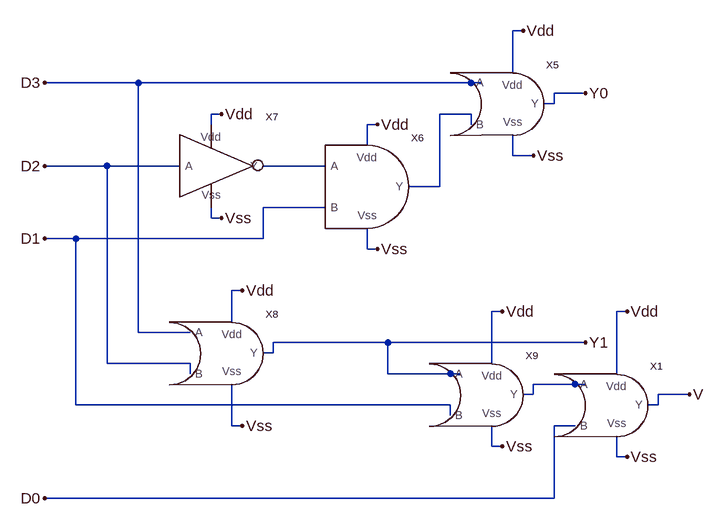
[diagram p0: schematic priority_encoder.asc]
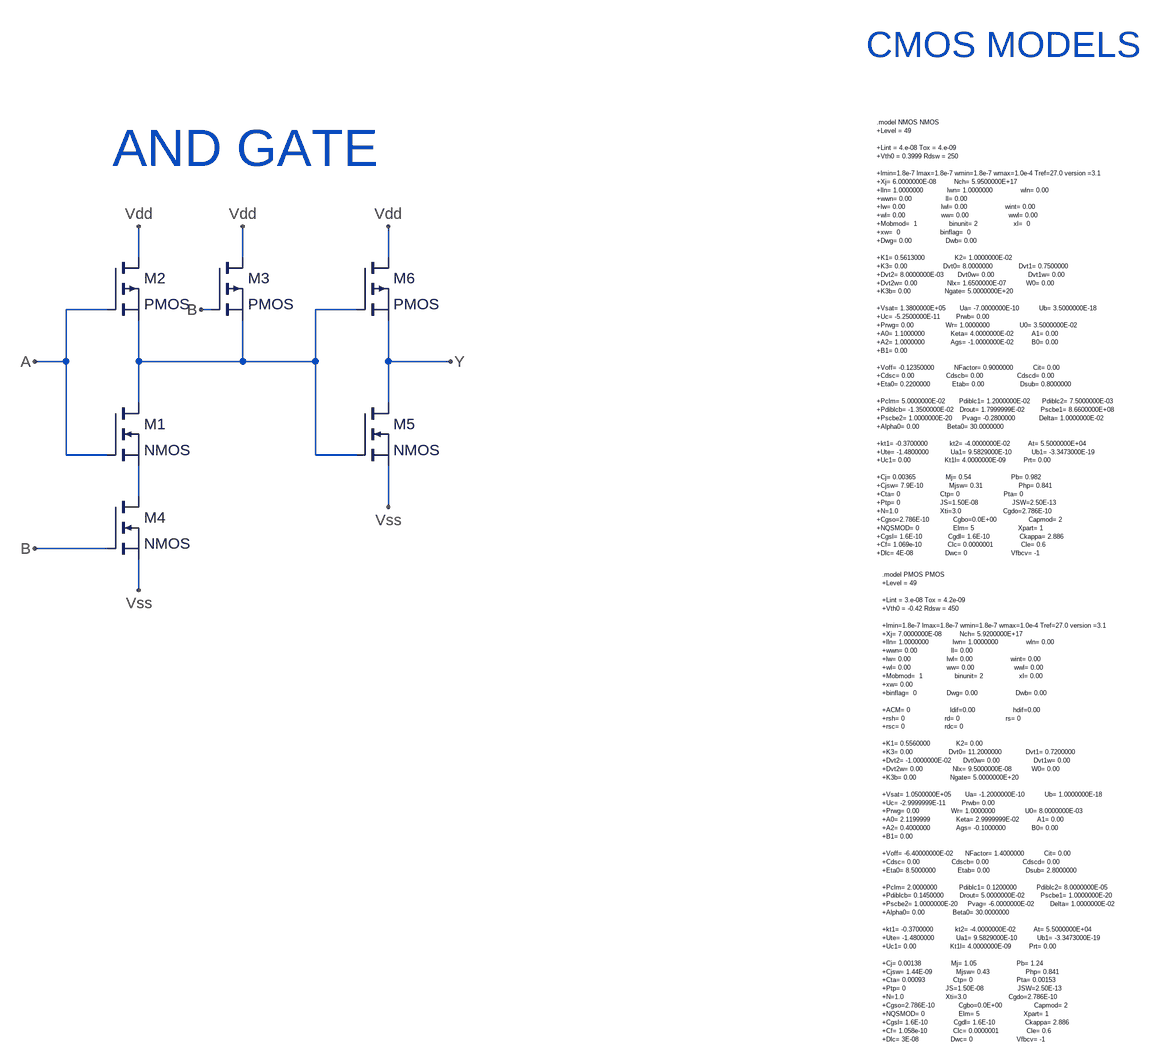
[diagram p1: sub-circuit and.asc]
priority_encoder.asc, the LTspice schematic file:
Version 4
SHEET 1 1840 712
WIRE 768 -112 752 -112
WIRE 752 -48 752 -112
WIRE 176 -32 32 -32
WIRE 688 -32 176 -32
WIRE 704 -32 688 -32
WIRE 864 -16 816 -16
WIRE 816 0 816 -16
WIRE 816 0 800 0
WIRE 304 16 288 16
WIRE 688 16 640 16
WIRE 288 32 288 16
WIRE 544 32 528 32
WIRE 688 32 688 16
WIRE 528 64 528 32
WIRE 752 80 752 48
WIRE 784 80 752 80
WIRE 128 96 32 96
WIRE 240 96 128 96
WIRE 464 96 368 96
WIRE 640 128 640 16
WIRE 640 128 592 128
WIRE 464 160 368 160
WIRE 288 176 288 160
WIRE 304 176 288 176
WIRE 80 208 32 208
WIRE 368 208 368 160
WIRE 368 208 80 208
WIRE 528 224 528 192
WIRE 544 224 528 224
WIRE 336 288 320 288
WIRE 736 320 720 320
WIRE 928 320 912 320
WIRE 320 336 320 288
WIRE 176 352 176 -32
WIRE 256 352 176 352
WIRE 560 368 384 368
WIRE 864 368 560 368
WIRE 384 384 384 368
WIRE 384 384 368 384
WIRE 128 400 128 96
WIRE 256 400 128 400
WIRE 720 400 720 320
WIRE 256 416 256 400
WIRE 560 416 560 368
WIRE 656 416 560 416
WIRE 672 416 656 416
WIRE 912 416 912 320
WIRE 848 432 784 432
WIRE 864 432 848 432
WIRE 784 448 784 432
WIRE 784 448 768 448
WIRE 1024 448 976 448
WIRE 80 464 80 208
WIRE 656 464 80 464
WIRE 976 464 976 448
WIRE 976 464 960 464
WIRE 656 480 656 464
WIRE 320 496 320 432
WIRE 336 496 320 496
WIRE 848 496 816 496
WIRE 720 528 720 496
WIRE 736 528 720 528
WIRE 912 544 912 512
WIRE 928 544 912 544
WIRE 816 608 816 496
WIRE 816 608 32 608
FLAG 32 208 D1
FLAG 32 96 D2
FLAG 32 -32 D3
FLAG 32 608 D0
FLAG 864 -16 Y0
FLAG 864 368 Y1
FLAG 1024 448 V
FLAG 304 16 Vdd
FLAG 544 32 Vdd
FLAG 768 -112 Vdd
FLAG 736 320 Vdd
FLAG 928 320 Vdd
FLAG 336 288 Vdd
FLAG 304 176 Vss
FLAG 544 224 Vss
FLAG 784 80 Vss
FLAG 736 528 Vss
FLAG 336 496 Vss
FLAG 928 544 Vss
SYMBOL or 768 -16 R0
SYMATTR InstName X5
SYMBOL and 528 128 R0
SYMATTR InstName X6
SYMBOL not 272 96 R0
SYMATTR InstName X7
SYMBOL or 336 368 R0
SYMATTR InstName X8
SYMBOL or 736 432 R0
SYMATTR InstName X9
SYMBOL or 928 448 R0
SYMATTR InstName X1

and.asc, the sub-circuit schematic file:
Version 4
SHEET 1 1908 1220
WIRE 368 64 368 16
WIRE 528 64 528 16
WIRE 752 64 752 16
WIRE 320 144 256 144
WIRE 480 144 464 144
WIRE 704 144 640 144
WIRE 256 224 256 144
WIRE 256 224 208 224
WIRE 368 224 368 160
WIRE 528 224 528 160
WIRE 528 224 368 224
WIRE 640 224 640 144
WIRE 640 224 528 224
WIRE 752 224 752 160
WIRE 848 224 752 224
WIRE 368 288 368 224
WIRE 752 288 752 224
WIRE 256 368 256 224
WIRE 320 368 256 368
WIRE 640 368 640 224
WIRE 704 368 640 368
WIRE 368 432 368 384
WIRE 752 448 752 384
WIRE 320 512 208 512
WIRE 368 576 368 528
FLAG 368 16 Vdd
FLAG 208 224 A
FLAG 528 16 Vdd
FLAG 208 512 B
FLAG 464 144 B
FLAG 752 16 Vdd
FLAG 848 224 Y
FLAG 368 576 Vss
FLAG 752 448 Vss
SYMBOL nmos 320 288 R0
SYMATTR InstName M1
SYMATTR Value2 L=0.18u W=1.0e-4
SYMBOL pmos 320 64 R0
SYMATTR InstName M2
SYMATTR Value2 L=0.18u W=1.0e-4
SYMBOL pmos 480 64 R0
SYMATTR InstName M3
SYMATTR Value2 L=0.18u W=1.0e-4
SYMBOL nmos 320 432 R0
SYMATTR InstName M4
SYMATTR Value2 L=0.18u W=1.0e-4
SYMBOL nmos 704 288 R0
SYMATTR InstName M5
SYMATTR Value2 L=0.18u W=1.0e-4
SYMBOL pmos 704 64 R0
SYMATTR InstName M6
SYMATTR Value2 L=0.18u W=1.0e-4
TEXT 328 -104 Left 6 ;AND GATE
TEXT 1504 -144 Left 0 !.model NMOS NMOS\n+Level = 49\n \n+Lint = 4.e-08 Tox = 4.e-09 \n+Vth0 = 0.3999 Rdsw = 250 \n \n+lmin=1.8e-7 lmax=1.8e-7 wmin=1.8e-7 wmax=1.0e-4 Tref=27.0 version =3.1\n+Xj= 6.0000000E-08         Nch= 5.9500000E+17 \n+lln= 1.0000000            lwn= 1.0000000              wln= 0.00\n+wwn= 0.00                 ll= 0.00\n+lw= 0.00                  lwl= 0.00                   wint= 0.00\n+wl= 0.00                  ww= 0.00                    wwl= 0.00\n+Mobmod=  1                binunit= 2                  xl=  0\n+xw=  0                    binflag=  0\n+Dwg= 0.00                 Dwb= 0.00 \n \n+K1= 0.5613000               K2= 1.0000000E-02 \n+K3= 0.00                  Dvt0= 8.0000000             Dvt1= 0.7500000 \n+Dvt2= 8.0000000E-03       Dvt0w= 0.00                 Dvt1w= 0.00 \n+Dvt2w= 0.00               Nlx= 1.6500000E-07          W0= 0.00 \n+K3b= 0.00                 Ngate= 5.0000000E+20 \n \n+Vsat= 1.3800000E+05       Ua= -7.0000000E-10          Ub= 3.5000000E-18 \n+Uc= -5.2500000E-11        Prwb= 0.00 \n+Prwg= 0.00                Wr= 1.0000000               U0= 3.5000000E-02 \n+A0= 1.1000000             Keta= 4.0000000E-02         A1= 0.00 \n+A2= 1.0000000             Ags= -1.0000000E-02         B0= 0.00 \n+B1= 0.00 \n \n+Voff= -0.12350000          NFactor= 0.9000000          Cit= 0.00 \n+Cdsc= 0.00                Cdscb= 0.00                 Cdscd= 0.00 \n+Eta0= 0.2200000           Etab= 0.00                  Dsub= 0.8000000 \n \n+Pclm= 5.0000000E-02       Pdiblc1= 1.2000000E-02      Pdiblc2= 7.5000000E-03 \n+Pdiblcb= -1.3500000E-02   Drout= 1.7999999E-02        Pscbe1= 8.6600000E+08 \n+Pscbe2= 1.0000000E-20     Pvag= -0.2800000            Delta= 1.0000000E-02 \n+Alpha0= 0.00              Beta0= 30.0000000 \n \n+kt1= -0.3700000           kt2= -4.0000000E-02         At= 5.5000000E+04 \n+Ute= -1.4800000           Ua1= 9.5829000E-10          Ub1= -3.3473000E-19 \n+Uc1= 0.00                 Kt1l= 4.0000000E-09         Prt= 0.00 \n \n+Cj= 0.00365               Mj= 0.54                    Pb= 0.982\n+Cjsw= 7.9E-10             Mjsw= 0.31                  Php= 0.841\n+Cta= 0                    Ctp= 0                      Pta= 0\n+Ptp= 0                    JS=1.50E-08                 JSW=2.50E-13\n+N=1.0                     Xti=3.0                     Cgdo=2.786E-10\n+Cgso=2.786E-10            Cgbo=0.0E+00                Capmod= 2\n+NQSMOD= 0                 Elm= 5                      Xpart= 1\n+Cgsl= 1.6E-10             Cgdl= 1.6E-10               Ckappa= 2.886\n+Cf= 1.069e-10             Clc= 0.0000001              Cle= 0.6\n+Dlc= 4E-08                Dwc= 0                      Vfbcv= -1
TEXT 1512 552 Left 0 !.model PMOS PMOS\n+Level = 49\n \n+Lint = 3.e-08 Tox = 4.2e-09 \n+Vth0 = -0.42 Rdsw = 450 \n \n+lmin=1.8e-7 lmax=1.8e-7 wmin=1.8e-7 wmax=1.0e-4 Tref=27.0 version =3.1\n+Xj= 7.0000000E-08         Nch= 5.9200000E+17 \n+lln= 1.0000000            lwn= 1.0000000              wln= 0.00\n+wwn= 0.00                 ll= 0.00\n+lw= 0.00                  lwl= 0.00                   wint= 0.00\n+wl= 0.00                  ww= 0.00                    wwl= 0.00\n+Mobmod=  1                binunit= 2                  xl= 0.00\n+xw= 0.00                  \n+binflag=  0               Dwg= 0.00                   Dwb= 0.00 \n \n+ACM= 0                    ldif=0.00                   hdif=0.00\n+rsh= 0                    rd= 0                       rs= 0\n+rsc= 0                    rdc= 0\n \n+K1= 0.5560000             K2= 0.00 \n+K3= 0.00                  Dvt0= 11.2000000            Dvt1= 0.7200000 \n+Dvt2= -1.0000000E-02      Dvt0w= 0.00                 Dvt1w= 0.00 \n+Dvt2w= 0.00               Nlx= 9.5000000E-08          W0= 0.00 \n+K3b= 0.00                 Ngate= 5.0000000E+20 \n \n+Vsat= 1.0500000E+05       Ua= -1.2000000E-10          Ub= 1.0000000E-18 \n+Uc= -2.9999999E-11        Prwb= 0.00 \n+Prwg= 0.00                Wr= 1.0000000               U0= 8.0000000E-03 \n+A0= 2.1199999             Keta= 2.9999999E-02         A1= 0.00 \n+A2= 0.4000000             Ags= -0.1000000             B0= 0.00 \n+B1= 0.00 \n \n+Voff= -6.40000000E-02      NFactor= 1.4000000          Cit= 0.00 \n+Cdsc= 0.00                Cdscb= 0.00                 Cdscd= 0.00 \n+Eta0= 8.5000000           Etab= 0.00                  Dsub= 2.8000000 \n \n+Pclm= 2.0000000           Pdiblc1= 0.1200000          Pdiblc2= 8.0000000E-05 \n+Pdiblcb= 0.1450000        Drout= 5.0000000E-02        Pscbe1= 1.0000000E-20 \n+Pscbe2= 1.0000000E-20     Pvag= -6.0000000E-02        Delta= 1.0000000E-02 \n+Alpha0= 0.00              Beta0= 30.0000000 \n \n+kt1= -0.3700000           kt2= -4.0000000E-02         At= 5.5000000E+04 \n+Ute= -1.4800000           Ua1= 9.5829000E-10          Ub1= -3.3473000E-19 \n+Uc1= 0.00                 Kt1l= 4.0000000E-09         Prt= 0.00 \n \n+Cj= 0.00138               Mj= 1.05                    Pb= 1.24\n+Cjsw= 1.44E-09            Mjsw= 0.43                  Php= 0.841\n+Cta= 0.00093              Ctp= 0                      Pta= 0.00153\n+Ptp= 0                    JS=1.50E-08                 JSW=2.50E-13\n+N=1.0                     Xti=3.0                     Cgdo=2.786E-10\n+Cgso=2.786E-10            Cgbo=0.0E+00                Capmod= 2\n+NQSMOD= 0                 Elm= 5                      Xpart= 1\n+Cgsl= 1.6E-10             Cgdl= 1.6E-10               Ckappa= 2.886\n+Cf= 1.058e-10             Clc= 0.0000001              Cle= 0.6\n+Dlc= 3E-08                Dwc= 0                      Vfbcv= -1
TEXT 1488 -264 Left 5 ;CMOS MODELS

The netlist it stands for:
* priority_encoder.asc
XX5 D3 N001 Vdd Vss Y0 or  ; pins A B Vdd Vss Y
XX6 Vdd Vss N002 D1 N001 and
XX7 N002 D2 Vdd Vss not  ; pins Y A Vdd Vss
XX8 D3 D2 Vdd Vss Y1 or  ; pins A B Vdd Vss Y
XX9 Y1 D1 Vdd Vss N003 or  ; pins A B Vdd Vss Y
XX1 N003 D0 Vdd Vss V or  ; pins A B Vdd Vss Y

* block symbol definitions
.subckt and Vdd Vss A B Y
M1 N001 A N002 N002 NMOS L=0.18u W=1.0e-4
M2 Vdd A N001 N001 PMOS L=0.18u W=1.0e-4
M3 Vdd B N001 N001 PMOS L=0.18u W=1.0e-4
M4 N002 B Vss Vss NMOS L=0.18u W=1.0e-4
M5 Y N001 Vss Vss NMOS L=0.18u W=1.0e-4
M6 Vdd N001 Y Y PMOS L=0.18u W=1.0e-4
* AND GATE
.model NMOS NMOS
+Level = 49
+Lint = 4.e-08 Tox = 4.e-09
+Vth0 = 0.3999 Rdsw = 250
+lmin=1.8e-7 lmax=1.8e-7 wmin=1.8e-7 wmax=1.0e-4 Tref=27.0 version =3.1
+Xj= 6.0000000E-08         Nch= 5.9500000E+17
+lln= 1.0000000            lwn= 1.0000000              wln= 0.00
+wwn= 0.00                 ll= 0.00
+lw= 0.00                  lwl= 0.00                   wint= 0.00
+wl= 0.00                  ww= 0.00                    wwl= 0.00
+Mobmod=  1                binunit= 2                  xl=  0
+xw=  0                    binflag=  0
+Dwg= 0.00                 Dwb= 0.00
+K1= 0.5613000               K2= 1.0000000E-02
+K3= 0.00                  Dvt0= 8.0000000             Dvt1= 0.7500000
+Dvt2= 8.0000000E-03       Dvt0w= 0.00                 Dvt1w= 0.00
+Dvt2w= 0.00               Nlx= 1.6500000E-07          W0= 0.00
+K3b= 0.00                 Ngate= 5.0000000E+20
+Vsat= 1.3800000E+05       Ua= -7.0000000E-10          Ub= 3.5000000E-18
+Uc= -5.2500000E-11        Prwb= 0.00
+Prwg= 0.00                Wr= 1.0000000               U0= 3.5000000E-02
+A0= 1.1000000             Keta= 4.0000000E-02         A1= 0.00
+A2= 1.0000000             Ags= -1.0000000E-02         B0= 0.00
+B1= 0.00
+Voff= -0.12350000          NFactor= 0.9000000          Cit= 0.00
+Cdsc= 0.00                Cdscb= 0.00                 Cdscd= 0.00
+Eta0= 0.2200000           Etab= 0.00                  Dsub= 0.8000000
+Pclm= 5.0000000E-02       Pdiblc1= 1.2000000E-02      Pdiblc2= 7.5000000E-03
+Pdiblcb= -1.3500000E-02   Drout= 1.7999999E-02        Pscbe1= 8.6600000E+08
+Pscbe2= 1.0000000E-20     Pvag= -0.2800000            Delta= 1.0000000E-02
+Alpha0= 0.00              Beta0= 30.0000000
+kt1= -0.3700000           kt2= -4.0000000E-02         At= 5.5000000E+04
+Ute= -1.4800000           Ua1= 9.5829000E-10          Ub1= -3.3473000E-19
+Uc1= 0.00                 Kt1l= 4.0000000E-09         Prt= 0.00
+Cj= 0.00365               Mj= 0.54                    Pb= 0.982
+Cjsw= 7.9E-10             Mjsw= 0.31                  Php= 0.841
+Cta= 0                    Ctp= 0                      Pta= 0
+Ptp= 0                    JS=1.50E-08                 JSW=2.50E-13
+N=1.0                     Xti=3.0                     Cgdo=2.786E-10
+Cgso=2.786E-10            Cgbo=0.0E+00                Capmod= 2
+NQSMOD= 0                 Elm= 5                      Xpart= 1
+Cgsl= 1.6E-10             Cgdl= 1.6E-10               Ckappa= 2.886
+Cf= 1.069e-10             Clc= 0.0000001              Cle= 0.6
+Dlc= 4E-08                Dwc= 0                      Vfbcv= -1
.model PMOS PMOS
+Level = 49
+Lint = 3.e-08 Tox = 4.2e-09
+Vth0 = -0.42 Rdsw = 450
+lmin=1.8e-7 lmax=1.8e-7 wmin=1.8e-7 wmax=1.0e-4 Tref=27.0 version =3.1
+Xj= 7.0000000E-08         Nch= 5.9200000E+17
+lln= 1.0000000            lwn= 1.0000000              wln= 0.00
+wwn= 0.00                 ll= 0.00
+lw= 0.00                  lwl= 0.00                   wint= 0.00
+wl= 0.00                  ww= 0.00                    wwl= 0.00
+Mobmod=  1                binunit= 2                  xl= 0.00
+xw= 0.00
+binflag=  0               Dwg= 0.00                   Dwb= 0.00
+ACM= 0                    ldif=0.00                   hdif=0.00
+rsh= 0                    rd= 0                       rs= 0
+rsc= 0                    rdc= 0
+K1= 0.5560000             K2= 0.00
+K3= 0.00                  Dvt0= 11.2000000            Dvt1= 0.7200000
+Dvt2= -1.0000000E-02      Dvt0w= 0.00                 Dvt1w= 0.00
+Dvt2w= 0.00               Nlx= 9.5000000E-08          W0= 0.00
+K3b= 0.00                 Ngate= 5.0000000E+20
+Vsat= 1.0500000E+05       Ua= -1.2000000E-10          Ub= 1.0000000E-18
+Uc= -2.9999999E-11        Prwb= 0.00
+Prwg= 0.00                Wr= 1.0000000               U0= 8.0000000E-03
+A0= 2.1199999             Keta= 2.9999999E-02         A1= 0.00
+A2= 0.4000000             Ags= -0.1000000             B0= 0.00
+B1= 0.00
+Voff= -6.40000000E-02      NFactor= 1.4000000          Cit= 0.00
+Cdsc= 0.00                Cdscb= 0.00                 Cdscd= 0.00
+Eta0= 8.5000000           Etab= 0.00                  Dsub= 2.8000000
+Pclm= 2.0000000           Pdiblc1= 0.1200000          Pdiblc2= 8.0000000E-05
+Pdiblcb= 0.1450000        Drout= 5.0000000E-02        Pscbe1= 1.0000000E-20
+Pscbe2= 1.0000000E-20     Pvag= -6.0000000E-02        Delta= 1.0000000E-02
+Alpha0= 0.00              Beta0= 30.0000000
+kt1= -0.3700000           kt2= -4.0000000E-02         At= 5.5000000E+04
+Ute= -1.4800000           Ua1= 9.5829000E-10          Ub1= -3.3473000E-19
+Uc1= 0.00                 Kt1l= 4.0000000E-09         Prt= 0.00
+Cj= 0.00138               Mj= 1.05                    Pb= 1.24
+Cjsw= 1.44E-09            Mjsw= 0.43                  Php= 0.841
+Cta= 0.00093              Ctp= 0                      Pta= 0.00153
+Ptp= 0                    JS=1.50E-08                 JSW=2.50E-13
+N=1.0                     Xti=3.0                     Cgdo=2.786E-10
+Cgso=2.786E-10            Cgbo=0.0E+00                Capmod= 2
+NQSMOD= 0                 Elm= 5                      Xpart= 1
+Cgsl= 1.6E-10             Cgdl= 1.6E-10               Ckappa= 2.886
+Cf= 1.058e-10             Clc= 0.0000001              Cle= 0.6
+Dlc= 3E-08                Dwc= 0                      Vfbcv= -1
* CMOS MODELS
.ends and

.model NMOS NMOS
.model PMOS PMOS
.lib standard.mos
.backanno
.end